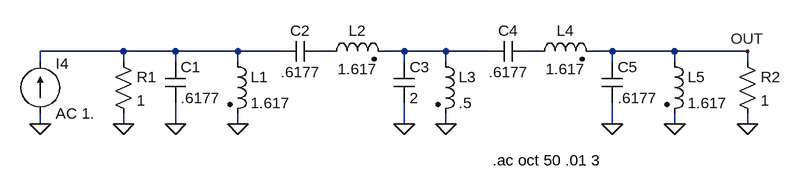
[diagram p0: schematic complex.asc]
complex.asc, the LTspice schematic file:
Version 4
SHEET 1 2536 1712
WIRE 1008 1136 1008 1120
WIRE 1008 1232 1008 1216
WIRE 1136 1120 1008 1120
WIRE 1136 1136 1136 1120
WIRE 1136 1232 1136 1216
WIRE 1216 1120 1136 1120
WIRE 1216 1136 1216 1120
WIRE 1216 1232 1216 1200
WIRE 1312 1120 1216 1120
WIRE 1312 1136 1312 1120
WIRE 1312 1232 1312 1216
WIRE 1376 1120 1312 1120
WIRE 1456 1120 1440 1120
WIRE 1568 1120 1536 1120
WIRE 1568 1136 1568 1120
WIRE 1568 1232 1568 1200
WIRE 1632 1120 1568 1120
WIRE 1632 1136 1632 1120
WIRE 1632 1232 1632 1216
WIRE 1696 1120 1632 1120
WIRE 1776 1120 1760 1120
WIRE 1888 1120 1856 1120
WIRE 1888 1136 1888 1120
WIRE 1888 1232 1888 1200
WIRE 1984 1120 1888 1120
WIRE 1984 1136 1984 1120
WIRE 1984 1232 1984 1216
WIRE 2096 1120 1984 1120
WIRE 2096 1136 2096 1120
WIRE 2096 1232 2096 1216
FLAG 2096 1120 OUT
FLAG 1008 1232 0
FLAG 1136 1232 0
FLAG 1216 1232 0
FLAG 1312 1232 0
FLAG 1568 1232 0
FLAG 1632 1232 0
FLAG 1888 1232 0
FLAG 1984 1232 0
FLAG 2096 1232 0
SYMBOL CURRENT 1008 1216 M180
WINDOW 0 24 77 Left 0
WINDOW 3 24 0 Left 0
SYMATTR InstName I4
SYMATTR Value AC 1.
SYMBOL CAP 1760 1104 R90
WINDOW 0 0 32 VBottom 0
WINDOW 3 32 32 VTop 0
SYMATTR InstName C4
SYMATTR Value .6177
SYMBOL CAP 1872 1136 R0
SYMATTR InstName C5
SYMATTR Value .6177
SYMBOL CAP 1440 1104 R90
WINDOW 0 0 32 VBottom 0
WINDOW 3 32 32 VTop 0
SYMATTR InstName C2
SYMATTR Value .6177
SYMBOL CAP 1552 1136 R0
SYMATTR InstName C3
SYMATTR Value 2
SYMBOL CAP 1200 1136 R0
SYMATTR InstName C1
SYMATTR Value .6177
SYMBOL IND2 1760 1136 R270
WINDOW 0 32 56 VTop 0
WINDOW 3 4 56 VBottom 0
SYMATTR InstName L4
SYMATTR Value 1.617
SYMBOL IND2 1968 1120 R0
SYMATTR InstName L5
SYMATTR Value 1.617
SYMBOL IND2 1440 1136 R270
WINDOW 0 32 56 VTop 0
WINDOW 3 4 56 VBottom 0
SYMATTR InstName L2
SYMATTR Value 1.617
SYMBOL IND2 1616 1120 R0
SYMATTR InstName L3
SYMATTR Value .5
SYMBOL IND2 1296 1120 R0
SYMATTR InstName L1
SYMATTR Value 1.617
SYMBOL RES 1120 1120 R0
SYMATTR InstName R1
SYMATTR Value 1
SYMBOL RES 2080 1120 R0
SYMATTR InstName R2
SYMATTR Value 1
TEXT 1704 1288 Left 0 !.ac oct 50 .01 3

The netlist it stands for:
* complex.asc
I4 0 N001 AC 1.
C4 N004 N003 .6177
C5 OUT 0 .6177
C2 N002 N001 .6177
C3 N003 0 2
C1 N001 0 .6177
L4 N004 OUT 1.617
L5 OUT 0 1.617
L2 N002 N003 1.617
L3 N003 0 .5
L1 N001 0 1.617
R1 N001 0 1
R2 OUT 0 1
.ac oct 50 .01 3
.backanno
.end